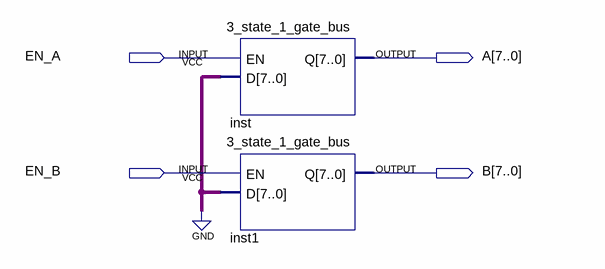
[diagram p0: schematic sheet]
// Quartus schematic zero2_bus.bdf as structural Verilog: 2 symbols, 4 pins
module zero2_bus (
  input  EN_A,
  input  EN_B,
  output [7:0] A,
  output [7:0] B
);

  \3_state_1_gate_bus  inst (.EN(EN_A), .D({8{1'b0}}), .Q(A));
  \3_state_1_gate_bus  inst1 (.EN(EN_B), .D({8{1'b0}}), .Q(B));
endmodule
